# Altium schematic sheet main_hall_crossboard_1_1.SchDoc
size A3
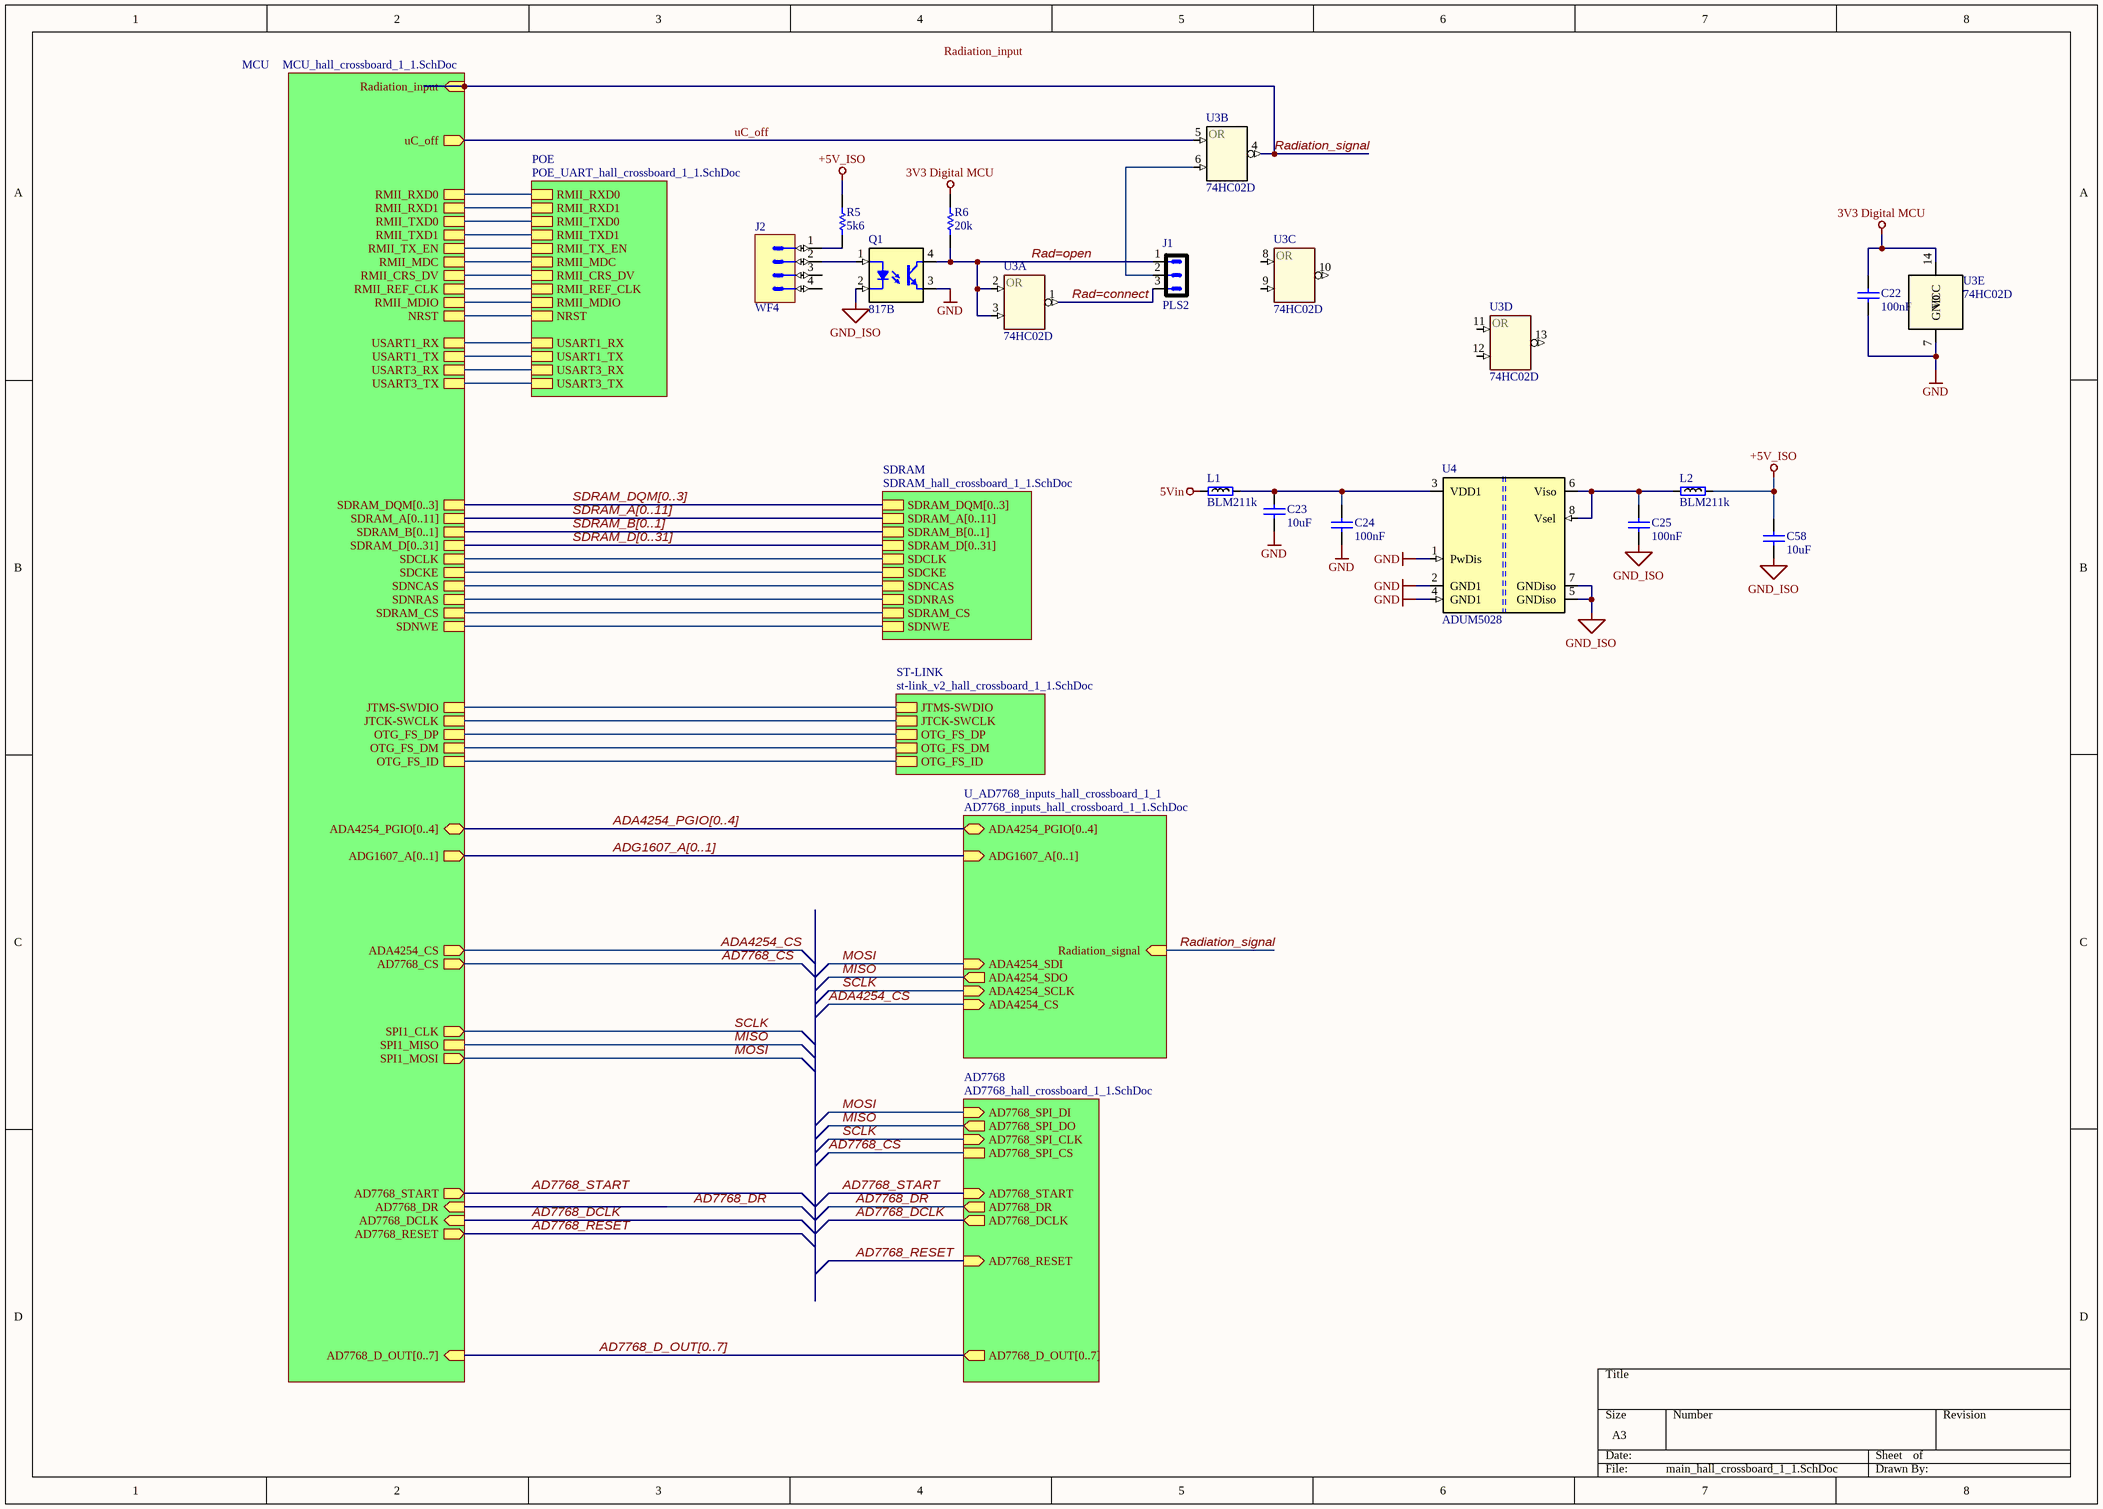
[diagram p0: main_hall_crossboard_1_1.SchDoc]

## Parts
C22  100nF  [0603C]
C23  10uF  [0805C]
C24  100nF  [0603C]
C25  100nF  [0603C]
C58  10uF  [0805C]
J1  PLS2  [COMATEL_385.0358.1.03.400]
J2  WF4  [WF4_2_54]
L1  BLM211k  [RESC2012X50N]
L2  BLM211k  [RESC2012X50N]
Q1  817B  [DIP4-300]
R5  5k6  [0603R]
R6  20k  [0603R]
U3  74HC02D  [SOIC127P600X175-14N]  (parts A,B,C,D,E of 5)
U4  ADUM5028  [SOIC127P600X175-8N]

## Sub-sheets
AD7768 = AD7768_hall_crossboard_1_1.SchDoc: AD7768_SPI_DI (in), AD7768_SPI_DO (out), AD7768_SPI_CLK (in), AD7768_SPI_CS, AD7768_DR (out), AD7768_RESET (in), AD7768_START (in), AD7768_DCLK (out), AD7768_D_OUT[0..7] (out)
MCU = MCU_hall_crossboard_1_1.SchDoc: RMII_RXD0, RMII_RXD1, RMII_TXD0, RMII_TXD1, RMII_TX_EN, RMII_MDC, RMII_CRS_DV, RMII_REF_CLK, RMII_MDIO, NRST, SPI1_CLK (out), SPI1_MISO, SPI1_MOSI (out), SDRAM_DQM[0..3], SDRAM_A[0..11], SDRAM_D[0..31], SDRAM_B[0..1], SDCLK, SDCKE, SDNCAS, SDNRAS, SDRAM_CS, SDNWE, USART1_RX, USART1_TX, USART3_RX, USART3_TX, JTMS-SWDIO, JTCK-SWCLK, OTG_FS_DP, OTG_FS_DM, OTG_FS_ID, Radiation_input (in), ADA4254_PGIO[0..4] (bidir), ADG1607_A[0..1] (out), ADA4254_CS (out), AD7768_CS (out), uC_off (out), AD7768_START (out), AD7768_DR (in), AD7768_DCLK (in), AD7768_RESET (out), AD7768_D_OUT[0..7] (in)
POE = POE_UART_hall_crossboard_1_1.SchDoc: RMII_RXD0, RMII_RXD1, RMII_TXD0, RMII_TXD1, RMII_TX_EN, RMII_MDC, RMII_CRS_DV, RMII_REF_CLK, RMII_MDIO, NRST, USART1_RX, USART1_TX, USART3_RX, USART3_TX
SDRAM = SDRAM_hall_crossboard_1_1.SchDoc: SDRAM_DQM[0..3], SDRAM_A[0..11], SDRAM_D[0..31], SDRAM_B[0..1], SDCLK, SDCKE, SDNCAS, SDNRAS, SDRAM_CS, SDNWE
ST-LINK = st-link_v2_hall_crossboard_1_1.SchDoc: JTMS-SWDIO, JTCK-SWCLK, OTG_FS_DP, OTG_FS_DM, OTG_FS_ID
U_AD7768_inputs_hall_crossboard_1_1 = AD7768_inputs_hall_crossboard_1_1.SchDoc: Radiation_signal (in), ADA4254_SDO (out), ADA4254_SDI (in), ADA4254_SCLK (in), ADA4254_CS (in), ADA4254_PGIO[0..4] (bidir), ADG1607_A[0..1] (in)

## Nets
3V3 Digital MCU: C22.2 R6.2 U3.14(VCC)
5Vin: L1.2
+5V_ISO: C58.2 L2.1 R5.2
GND: C22.1 C23.1 C24.1 Q1.3(E) U3.7(GND) U4.1(PwDis) U4.2(GND1) U4.4(GND1)
GND_ISO: C25.1 C58.1 Q1.2(C) U4.5(GNDiso) U4.7(GNDiso)
AD7768_CS: sheet MCU/AD7768_CS, sheet AD7768/AD7768_SPI_CS
AD7768_DCLK: sheet MCU/AD7768_DCLK, sheet AD7768/AD7768_DCLK
AD7768_DR: sheet MCU/AD7768_DR, sheet AD7768/AD7768_DR
AD7768_RESET: sheet MCU/AD7768_RESET, sheet AD7768/AD7768_RESET
AD7768_START: sheet MCU/AD7768_START, sheet AD7768/AD7768_START
ADA4254_CS: sheet MCU/ADA4254_CS, sheet U_AD7768_inputs_hall_crossboard_1_1/ADA4254_CS
MISO: sheet MCU/SPI1_MISO, sheet AD7768/AD7768_SPI_DO, sheet U_AD7768_inputs_hall_crossboard_1_1/ADA4254_SDO
MOSI: sheet MCU/SPI1_MOSI, sheet AD7768/AD7768_SPI_DI, sheet U_AD7768_inputs_hall_crossboard_1_1/ADA4254_SDI
Rad=connect: J1.3 U3.1(OUT)
Rad=open: J1.1 Q1.4(C) R6.1 U3.2(IN) U3.3(IN)
Radiation_signal: U3.4(OUT) ; sheet MCU/Radiation_input, sheet U_AD7768_inputs_hall_crossboard_1_1/Radiation_signal
SCLK: sheet MCU/SPI1_CLK, sheet AD7768/AD7768_SPI_CLK, sheet U_AD7768_inputs_hall_crossboard_1_1/ADA4254_SCLK
uC_off: U3.5(IN) ; sheet MCU/uC_off
NetC23_2: C23.2 C24.2 L1.1 U4.3(VDD1)
NetC25_2: C25.2 L2.2 U4.6(Viso) U4.8(Vsel)
NetJ1_2: J1.2 U3.6(IN)
NetJ2_1: J2.1 R5.1
NetJ2_2: J2.2 Q1.1(A)
(unnamed): sheet MCU/RMII_RXD0, sheet POE/RMII_RXD0
(unnamed): sheet MCU/RMII_RXD1, sheet POE/RMII_RXD1
(unnamed): sheet MCU/RMII_TXD0, sheet POE/RMII_TXD0
(unnamed): sheet MCU/RMII_TXD1, sheet POE/RMII_TXD1
(unnamed): sheet MCU/RMII_TX_EN, sheet POE/RMII_TX_EN
(unnamed): sheet MCU/RMII_MDC, sheet POE/RMII_MDC
(unnamed): sheet MCU/RMII_CRS_DV, sheet POE/RMII_CRS_DV
(unnamed): sheet MCU/RMII_REF_CLK, sheet POE/RMII_REF_CLK
(unnamed): sheet MCU/RMII_MDIO, sheet POE/RMII_MDIO
(unnamed): sheet MCU/NRST, sheet POE/NRST
(unnamed): sheet MCU/SDCLK, sheet SDRAM/SDCLK
(unnamed): sheet MCU/SDCKE, sheet SDRAM/SDCKE
(unnamed): sheet MCU/SDNCAS, sheet SDRAM/SDNCAS
(unnamed): sheet MCU/SDNRAS, sheet SDRAM/SDNRAS
(unnamed): sheet MCU/SDRAM_CS, sheet SDRAM/SDRAM_CS
(unnamed): sheet MCU/SDNWE, sheet SDRAM/SDNWE
(unnamed): sheet MCU/USART1_RX, sheet POE/USART1_RX
(unnamed): sheet MCU/USART1_TX, sheet POE/USART1_TX
(unnamed): sheet MCU/USART3_RX, sheet POE/USART3_RX
(unnamed): sheet MCU/USART3_TX, sheet POE/USART3_TX
(unnamed): sheet MCU/JTMS-SWDIO, sheet ST-LINK/JTMS-SWDIO
(unnamed): sheet MCU/JTCK-SWCLK, sheet ST-LINK/JTCK-SWCLK
(unnamed): sheet MCU/OTG_FS_DP, sheet ST-LINK/OTG_FS_DP
(unnamed): sheet MCU/OTG_FS_DM, sheet ST-LINK/OTG_FS_DM
(unnamed): sheet MCU/OTG_FS_ID, sheet ST-LINK/OTG_FS_ID

Not connected (* = marked no-connect by the designer): J2 3 4; U3 8(IN) 9(IN) 10(OUT) 11(IN) 12(IN) 13(OUT)

## Buses and harness runs
bus AD7768_D_OUT[0..7] = sheet AD7768/AD7768_D_OUT[0..7] = sheet MCU/AD7768_D_OUT[0..7]
bus ADA4254_PGIO[0..4] = sheet MCU/ADA4254_PGIO[0..4] = sheet U_AD7768_inputs_hall_crossboard_1_1/ADA4254_PGIO[0..4]
bus ADG1607_A[0..1] = sheet MCU/ADG1607_A[0..1] = sheet U_AD7768_inputs_hall_crossboard_1_1/ADG1607_A[0..1]
bus SDRAM_A[0..11] = sheet MCU/SDRAM_A[0..11] = sheet SDRAM/SDRAM_A[0..11]
bus SDRAM_B[0..1] = sheet MCU/SDRAM_B[0..1] = sheet SDRAM/SDRAM_B[0..1]
bus SDRAM_D[0..31] = sheet MCU/SDRAM_D[0..31] = sheet SDRAM/SDRAM_D[0..31]
bus SDRAM_DQM[0..3] = sheet MCU/SDRAM_DQM[0..3] = sheet SDRAM/SDRAM_DQM[0..3]

## Notes on the sheet
- Labels drawn without touching a wire or pin: Radiation_input
- (in symbol 74HC02D, part A) OR
- (in symbol 74HC02D, part B) OR
- (in symbol 74HC02D, part C) OR
- (in symbol 74HC02D, part D) OR

## Library data of the parts
C22-C25 C58 = Capacitor_ST: Capacitor 0402 / 0603 / 0805; Revision: July-2002: Re-released for DXP Platform.
  C22 C24 C25: Value: 100nF
  C23 C58: Value: 10uF
J1 = PLS3: Vendor: Confly; SMD Solders: 0; Solder Option: RM; THD Solders: 2; Price: 1; Device: PLS2
J2 = WF4: Вилка  WF4; Vendor: Confly; SMD Solders: 0; Solder Option: RM; THD Solders: 4; Price: 20; Device: WF4
L1 L2 = BLM21: SMD Ferrite bead 0805; Vendor: Vishay; Value: 1k; Pkg: SMD0805; SMD Solders: 2; Solder Option: RM; Device: BLM21; Price: 10
Q1 = 817B: Optotransistor; Pkg: DIP4; SMD Solders: 0; Solder Option: RM; THD Solders: 4; Vendor: UMW; Voltage: 35V; Device: 817B; Price: 10; Name to order: 817B; Current: 0
R5 R6 = Resistor_ST: Resistor 0402 / 0603 / 0805 c2
  R5: Value: 5k6
  R6: Value: 20k
U3 = 74HC02D: 4 лог. элемента 2ИЛИ-НЕ; Vendor: NXP; Pkg: SOIC14; SMD Solders: 14; Solder Option: RM; Voltage: 2.. 6V; Price: 50; Device: 74HC02D; Name to order: 74HC02D
U4 = ADUM5028: Isolateted DC DC 5V->5V or 3V3 60mA; Vendor: Analog Devoces; Pkg: SOIC8; SMD Solders: 8; Solder Option: RM; Name to order: ADuM5028-5BRIZ; Current: 200; Price: 2500; Device: ADUM5028